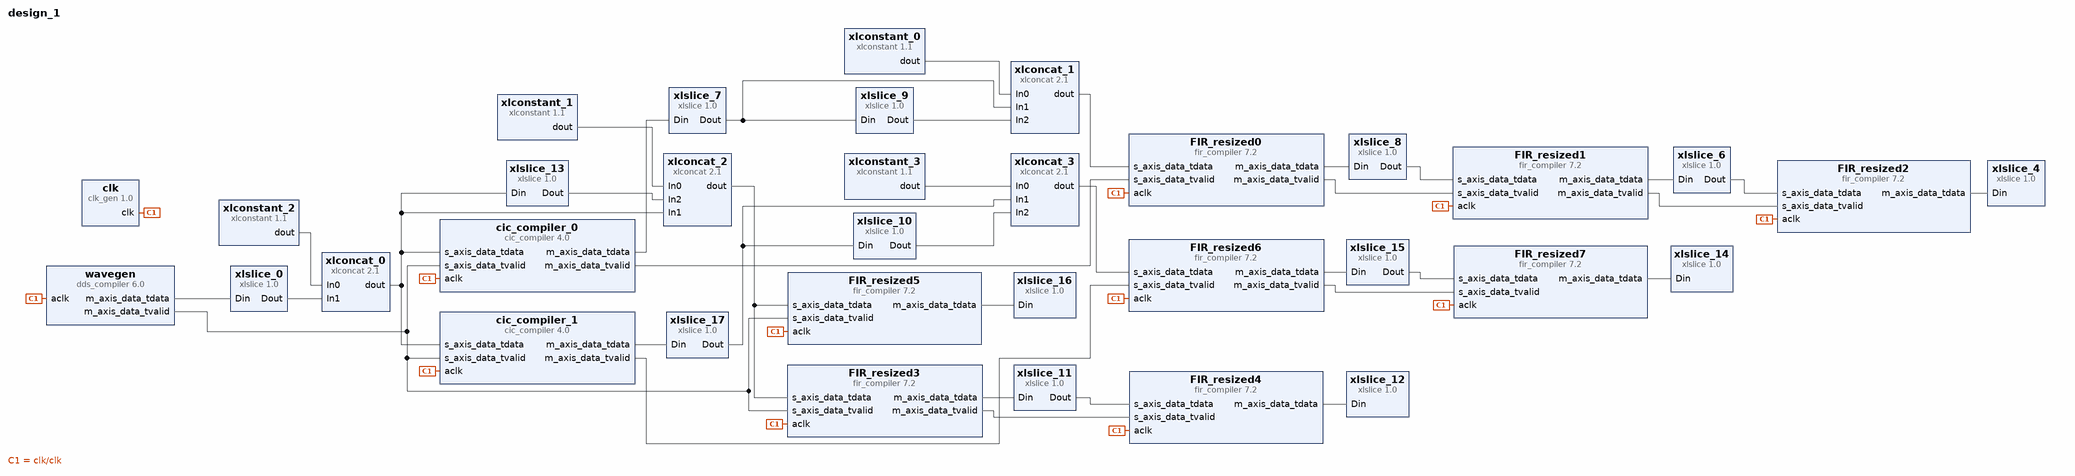
[diagram p0: block diagram of the top level]
# Vivado block design design_1, Vivado 2016.2
create_bd_design design_1

create_bd_cell -type ip -vlnv xilinx.com:ip:clk_gen:1.0 clk
set_property -dict {CONFIG.FREQ_HZ 125000000} [get_bd_cells clk]
create_bd_cell -type ip -vlnv xilinx.com:ip:dds_compiler:6.0 wavegen
set_property -dict [list \
  CONFIG.DDS_Clock_Rate 125 \
  CONFIG.Frequency_Resolution 0.4 \
  CONFIG.Noise_Shaping Auto \
  CONFIG.Phase_Width 29 \
  CONFIG.Output_Width 8 \
  CONFIG.Output_Frequency1 0.02 \
  CONFIG.PINC1 10100111110001011 \
] [get_bd_cells wavegen]
create_bd_cell -type ip -vlnv xilinx.com:ip:xlslice:1.0 xlslice_0
set_property -dict {CONFIG.DOUT_WIDTH 14 CONFIG.DIN_TO 2 CONFIG.DIN_FROM 15 CONFIG.DIN_WIDTH 16} [get_bd_cells xlslice_0]
create_bd_cell -type ip -vlnv xilinx.com:ip:xlconcat:2.1 xlconcat_0
set_property -dict {CONFIG.NUM_PORTS 2 CONFIG.IN0_WIDTH 2 CONFIG.IN1_WIDTH 14 CONFIG.IN2_WIDTH 1} [get_bd_cells xlconcat_0]
create_bd_cell -type ip -vlnv xilinx.com:ip:fir_compiler:7.2 FIR_resized1
set_property -dict [list \
  CONFIG.CoefficientSource COE_File \
  CONFIG.Coefficient_File ../../../../../../../pitaya/firmware/fpga/p_chain5/coefData/dec5flat.coe \
  CONFIG.Coefficient_Sets 1 \
  CONFIG.Filter_Type Decimation \
  CONFIG.Interpolation_Rate 1 \
  CONFIG.Decimation_Rate 5 \
  CONFIG.Zero_Pack_Factor 1 \
  CONFIG.Number_Channels 1 \
  CONFIG.RateSpecification Frequency_Specification \
  CONFIG.Sample_Frequency 125 \
  CONFIG.Clock_Frequency 125 \
  CONFIG.Coefficient_Sign Signed \
  CONFIG.Quantization Quantize_Only \
  CONFIG.Coefficient_Width 16 \
  CONFIG.Coefficient_Fractional_Bits 17 \
  CONFIG.Coefficient_Structure Inferred \
  CONFIG.Data_Width 24 \
  CONFIG.Data_Fractional_Bits 7 \
  CONFIG.Output_Rounding_Mode Truncate_LSBs \
  CONFIG.Output_Width 32 \
  CONFIG.Filter_Architecture Systolic_Multiply_Accumulate \
  CONFIG.ColumnConfig 7 \
] [get_bd_cells FIR_resized1]
create_bd_cell -type ip -vlnv xilinx.com:ip:xlslice:1.0 xlslice_4
set_property -dict {CONFIG.DOUT_WIDTH 24 CONFIG.DIN_TO 6 CONFIG.DIN_FROM 29 CONFIG.DIN_WIDTH 32} [get_bd_cells xlslice_4]
create_bd_cell -type ip -vlnv xilinx.com:ip:xlslice:1.0 xlslice_6
set_property -dict {CONFIG.DOUT_WIDTH 24 CONFIG.DIN_TO 7 CONFIG.DIN_FROM 30 CONFIG.DIN_WIDTH 32} [get_bd_cells xlslice_6]
create_bd_cell -type ip -vlnv xilinx.com:ip:fir_compiler:7.2 FIR_resized2
set_property -dict [list \
  CONFIG.CoefficientSource COE_File \
  CONFIG.Coefficient_File ../../../../../../../pitaya/firmware/fpga/p_chain5/coefData/dec5steep.coe \
  CONFIG.Coefficient_Sets 1 \
  CONFIG.Filter_Type Decimation \
  CONFIG.Interpolation_Rate 1 \
  CONFIG.Decimation_Rate 5 \
  CONFIG.Zero_Pack_Factor 1 \
  CONFIG.Number_Channels 1 \
  CONFIG.RateSpecification Frequency_Specification \
  CONFIG.Sample_Frequency 125 \
  CONFIG.Clock_Frequency 125 \
  CONFIG.Coefficient_Sign Signed \
  CONFIG.Quantization Quantize_Only \
  CONFIG.Coefficient_Width 16 \
  CONFIG.BestPrecision false \
  CONFIG.Coefficient_Fractional_Bits 17 \
  CONFIG.Coefficient_Structure Inferred \
  CONFIG.Data_Width 24 \
  CONFIG.Data_Fractional_Bits 7 \
  CONFIG.Output_Rounding_Mode Truncate_LSBs \
  CONFIG.Output_Width 32 \
  CONFIG.Filter_Architecture Systolic_Multiply_Accumulate \
  CONFIG.ColumnConfig 21 \
] [get_bd_cells FIR_resized2]
create_bd_cell -type ip -vlnv xilinx.com:ip:cic_compiler:4.0 cic_compiler_0
set_property -dict [list \
  CONFIG.Filter_Type Decimation \
  CONFIG.Number_Of_Stages 4 \
  CONFIG.Fixed_Or_Initial_Rate 25 \
  CONFIG.Minimum_Rate 25 \
  CONFIG.Maximum_Rate 25 \
  CONFIG.Input_Sample_Frequency 125 \
  CONFIG.Clock_Frequency 125 \
  CONFIG.SamplePeriod 1 \
  CONFIG.Input_Data_Width 16 \
  CONFIG.Output_Data_Width 35 \
] [get_bd_cells cic_compiler_0]
create_bd_cell -type ip -vlnv xilinx.com:ip:xlslice:1.0 xlslice_7
set_property -dict {CONFIG.DOUT_WIDTH 16 CONFIG.DIN_TO 19 CONFIG.DIN_FROM 34 CONFIG.DIN_WIDTH 40} [get_bd_cells xlslice_7]
create_bd_cell -type ip -vlnv xilinx.com:ip:fir_compiler:7.2 FIR_resized0
set_property -dict [list \
  CONFIG.CoefficientSource COE_File \
  CONFIG.Coefficient_File ../../../../../../../pitaya/firmware/fpga/p_chain5/coefData/comp025.coe \
  CONFIG.Coefficient_Sets 1 \
  CONFIG.Filter_Type Single_Rate \
  CONFIG.Interpolation_Rate 1 \
  CONFIG.Decimation_Rate 1 \
  CONFIG.Zero_Pack_Factor 1 \
  CONFIG.Number_Channels 1 \
  CONFIG.RateSpecification Frequency_Specification \
  CONFIG.Sample_Frequency 5 \
  CONFIG.Clock_Frequency 125 \
  CONFIG.Coefficient_Sign Signed \
  CONFIG.Quantization Quantize_Only \
  CONFIG.Coefficient_Width 16 \
  CONFIG.Coefficient_Fractional_Bits 16 \
  CONFIG.Coefficient_Structure Inferred \
  CONFIG.Data_Width 24 \
  CONFIG.Data_Fractional_Bits 7 \
  CONFIG.Output_Rounding_Mode Truncate_LSBs \
  CONFIG.Output_Width 32 \
  CONFIG.Filter_Architecture Systolic_Multiply_Accumulate \
  CONFIG.ColumnConfig 1 \
] [get_bd_cells FIR_resized0]
create_bd_cell -type ip -vlnv xilinx.com:ip:xlslice:1.0 xlslice_8
set_property -dict {CONFIG.DOUT_WIDTH 24 CONFIG.DIN_TO 7 CONFIG.DIN_FROM 30 CONFIG.DIN_WIDTH 32} [get_bd_cells xlslice_8]
create_bd_cell -type ip -vlnv xilinx.com:ip:xlconcat:2.1 xlconcat_1
set_property -dict {CONFIG.NUM_PORTS 3 CONFIG.IN0_WIDTH 7 CONFIG.IN1_WIDTH 16 CONFIG.IN2_WIDTH 1} [get_bd_cells xlconcat_1]
create_bd_cell -type ip -vlnv xilinx.com:ip:xlconstant:1.1 xlconstant_0
set_property -dict {CONFIG.CONST_WIDTH 7 CONFIG.CONST_VAL 0} [get_bd_cells xlconstant_0]
create_bd_cell -type ip -vlnv xilinx.com:ip:xlslice:1.0 xlslice_9
set_property -dict {CONFIG.DOUT_WIDTH 1 CONFIG.DIN_TO 15 CONFIG.DIN_FROM 15 CONFIG.DIN_WIDTH 16} [get_bd_cells xlslice_9]
create_bd_cell -type ip -vlnv xilinx.com:ip:fir_compiler:7.2 FIR_resized3
set_property -dict [list \
  CONFIG.CoefficientSource COE_File \
  CONFIG.Coefficient_File ../../../../../../../pitaya/firmware/fpga/p_chain5/coefData/dec5flat.coe \
  CONFIG.Coefficient_Sets 1 \
  CONFIG.Filter_Type Decimation \
  CONFIG.Interpolation_Rate 1 \
  CONFIG.Decimation_Rate 5 \
  CONFIG.Zero_Pack_Factor 1 \
  CONFIG.Number_Channels 1 \
  CONFIG.RateSpecification Frequency_Specification \
  CONFIG.Sample_Frequency 125 \
  CONFIG.Clock_Frequency 125 \
  CONFIG.Coefficient_Sign Signed \
  CONFIG.Quantization Quantize_Only \
  CONFIG.Coefficient_Width 16 \
  CONFIG.Coefficient_Fractional_Bits 17 \
  CONFIG.Coefficient_Structure Inferred \
  CONFIG.Data_Width 24 \
  CONFIG.Data_Fractional_Bits 7 \
  CONFIG.Output_Rounding_Mode Truncate_LSBs \
  CONFIG.Output_Width 32 \
  CONFIG.Filter_Architecture Systolic_Multiply_Accumulate \
  CONFIG.ColumnConfig 7 \
] [get_bd_cells FIR_resized3]
create_bd_cell -type ip -vlnv xilinx.com:ip:xlslice:1.0 xlslice_11
set_property -dict {CONFIG.DOUT_WIDTH 24 CONFIG.DIN_TO 7 CONFIG.DIN_FROM 30 CONFIG.DIN_WIDTH 32} [get_bd_cells xlslice_11]
create_bd_cell -type ip -vlnv xilinx.com:ip:fir_compiler:7.2 FIR_resized4
set_property -dict [list \
  CONFIG.CoefficientSource COE_File \
  CONFIG.Coefficient_File ../../../../../../../pitaya/firmware/fpga/p_chain5/coefData/dec5steep.coe \
  CONFIG.Coefficient_Sets 1 \
  CONFIG.Filter_Type Decimation \
  CONFIG.Interpolation_Rate 1 \
  CONFIG.Decimation_Rate 5 \
  CONFIG.Zero_Pack_Factor 1 \
  CONFIG.Number_Channels 1 \
  CONFIG.RateSpecification Frequency_Specification \
  CONFIG.Sample_Frequency 125 \
  CONFIG.Clock_Frequency 125 \
  CONFIG.Coefficient_Sign Signed \
  CONFIG.Quantization Quantize_Only \
  CONFIG.Coefficient_Width 16 \
  CONFIG.BestPrecision false \
  CONFIG.Coefficient_Fractional_Bits 17 \
  CONFIG.Coefficient_Structure Inferred \
  CONFIG.Data_Width 24 \
  CONFIG.Data_Fractional_Bits 7 \
  CONFIG.Output_Rounding_Mode Truncate_LSBs \
  CONFIG.Output_Width 32 \
  CONFIG.Filter_Architecture Systolic_Multiply_Accumulate \
  CONFIG.ColumnConfig 21 \
] [get_bd_cells FIR_resized4]
create_bd_cell -type ip -vlnv xilinx.com:ip:xlslice:1.0 xlslice_12
set_property -dict {CONFIG.DOUT_WIDTH 24 CONFIG.DIN_TO 6 CONFIG.DIN_FROM 29 CONFIG.DIN_WIDTH 32} [get_bd_cells xlslice_12]
create_bd_cell -type ip -vlnv xilinx.com:ip:xlconcat:2.1 xlconcat_2
set_property -dict {CONFIG.NUM_PORTS 3 CONFIG.IN0_WIDTH 7 CONFIG.IN1_WIDTH 16 CONFIG.IN2_WIDTH 1} [get_bd_cells xlconcat_2]
create_bd_cell -type ip -vlnv xilinx.com:ip:xlconstant:1.1 xlconstant_1
set_property -dict {CONFIG.CONST_WIDTH 7 CONFIG.CONST_VAL 0} [get_bd_cells xlconstant_1]
create_bd_cell -type ip -vlnv xilinx.com:ip:xlslice:1.0 xlslice_13
set_property -dict {CONFIG.DOUT_WIDTH 1 CONFIG.DIN_TO 15 CONFIG.DIN_FROM 15 CONFIG.DIN_WIDTH 16} [get_bd_cells xlslice_13]
create_bd_cell -type ip -vlnv xilinx.com:ip:xlconstant:1.1 xlconstant_2
set_property -dict {CONFIG.CONST_WIDTH 2 CONFIG.CONST_VAL 0} [get_bd_cells xlconstant_2]
create_bd_cell -type ip -vlnv xilinx.com:ip:fir_compiler:7.2 FIR_resized5
set_property -dict [list \
  CONFIG.CoefficientSource COE_File \
  CONFIG.Coefficient_File ../../../../../../../pitaya/firmware/fpga/p_chain5/coefData/dec5steep.coe \
  CONFIG.Coefficient_Sets 1 \
  CONFIG.Filter_Type Decimation \
  CONFIG.Interpolation_Rate 1 \
  CONFIG.Decimation_Rate 5 \
  CONFIG.Zero_Pack_Factor 1 \
  CONFIG.Number_Channels 1 \
  CONFIG.RateSpecification Frequency_Specification \
  CONFIG.Sample_Frequency 125 \
  CONFIG.Clock_Frequency 125 \
  CONFIG.Coefficient_Sign Signed \
  CONFIG.Quantization Quantize_Only \
  CONFIG.Coefficient_Width 16 \
  CONFIG.BestPrecision false \
  CONFIG.Coefficient_Fractional_Bits 17 \
  CONFIG.Coefficient_Structure Inferred \
  CONFIG.Data_Width 24 \
  CONFIG.Data_Fractional_Bits 7 \
  CONFIG.Output_Rounding_Mode Truncate_LSBs \
  CONFIG.Output_Width 32 \
  CONFIG.Filter_Architecture Systolic_Multiply_Accumulate \
  CONFIG.ColumnConfig 21 \
] [get_bd_cells FIR_resized5]
create_bd_cell -type ip -vlnv xilinx.com:ip:xlslice:1.0 xlslice_16
set_property -dict {CONFIG.DOUT_WIDTH 24 CONFIG.DIN_TO 6 CONFIG.DIN_FROM 29 CONFIG.DIN_WIDTH 32} [get_bd_cells xlslice_16]
create_bd_cell -type ip -vlnv xilinx.com:ip:cic_compiler:4.0 cic_compiler_1
set_property -dict [list \
  CONFIG.Filter_Type Decimation \
  CONFIG.Number_Of_Stages 4 \
  CONFIG.Fixed_Or_Initial_Rate 125 \
  CONFIG.Minimum_Rate 125 \
  CONFIG.Maximum_Rate 125 \
  CONFIG.Input_Sample_Frequency 125 \
  CONFIG.Clock_Frequency 125 \
  CONFIG.SamplePeriod 1 \
  CONFIG.Input_Data_Width 16 \
  CONFIG.Output_Data_Width 44 \
] [get_bd_cells cic_compiler_1]
create_bd_cell -type ip -vlnv xilinx.com:ip:fir_compiler:7.2 FIR_resized6
set_property -dict [list \
  CONFIG.CoefficientSource COE_File \
  CONFIG.Coefficient_File ../../../../../../../pitaya/firmware/fpga/p_chain5/coefData/comp125.coe \
  CONFIG.Coefficient_Sets 1 \
  CONFIG.Filter_Type Decimation \
  CONFIG.Interpolation_Rate 1 \
  CONFIG.Decimation_Rate 5 \
  CONFIG.Zero_Pack_Factor 1 \
  CONFIG.Number_Channels 1 \
  CONFIG.RateSpecification Frequency_Specification \
  CONFIG.Sample_Frequency 1 \
  CONFIG.Clock_Frequency 125 \
  CONFIG.Coefficient_Sign Signed \
  CONFIG.Quantization Quantize_Only \
  CONFIG.Coefficient_Width 16 \
  CONFIG.Coefficient_Fractional_Bits 16 \
  CONFIG.Coefficient_Structure Inferred \
  CONFIG.Data_Width 24 \
  CONFIG.Data_Fractional_Bits 7 \
  CONFIG.Output_Rounding_Mode Truncate_LSBs \
  CONFIG.Output_Width 32 \
  CONFIG.Filter_Architecture Systolic_Multiply_Accumulate \
  CONFIG.ColumnConfig 1 \
] [get_bd_cells FIR_resized6]
create_bd_cell -type ip -vlnv xilinx.com:ip:fir_compiler:7.2 FIR_resized7
set_property -dict [list \
  CONFIG.CoefficientSource COE_File \
  CONFIG.Coefficient_File ../../../../../../../pitaya/firmware/fpga/p_chain5/coefData/halfband.coe \
  CONFIG.Coefficient_Sets 1 \
  CONFIG.Filter_Type Decimation \
  CONFIG.Interpolation_Rate 1 \
  CONFIG.Decimation_Rate 2 \
  CONFIG.Zero_Pack_Factor 1 \
  CONFIG.Number_Channels 1 \
  CONFIG.RateSpecification Frequency_Specification \
  CONFIG.Sample_Frequency 0.5 \
  CONFIG.Clock_Frequency 125 \
  CONFIG.Coefficient_Sign Signed \
  CONFIG.Quantization Quantize_Only \
  CONFIG.Coefficient_Width 16 \
  CONFIG.BestPrecision false \
  CONFIG.Coefficient_Fractional_Bits 15 \
  CONFIG.Coefficient_Structure Inferred \
  CONFIG.Data_Width 24 \
  CONFIG.Data_Fractional_Bits 7 \
  CONFIG.Output_Rounding_Mode Truncate_LSBs \
  CONFIG.Output_Width 32 \
  CONFIG.Filter_Architecture Systolic_Multiply_Accumulate \
  CONFIG.ColumnConfig 1 \
] [get_bd_cells FIR_resized7]
create_bd_cell -type ip -vlnv xilinx.com:ip:xlslice:1.0 xlslice_14
set_property -dict {CONFIG.DOUT_WIDTH 24 CONFIG.DIN_TO 7 CONFIG.DIN_FROM 30 CONFIG.DIN_WIDTH 32} [get_bd_cells xlslice_14]
create_bd_cell -type ip -vlnv xilinx.com:ip:xlslice:1.0 xlslice_15
set_property -dict {CONFIG.DOUT_WIDTH 24 CONFIG.DIN_TO 7 CONFIG.DIN_FROM 30 CONFIG.DIN_WIDTH 32} [get_bd_cells xlslice_15]
create_bd_cell -type ip -vlnv xilinx.com:ip:xlconcat:2.1 xlconcat_3
set_property -dict {CONFIG.NUM_PORTS 3 CONFIG.IN0_WIDTH 7 CONFIG.IN1_WIDTH 16 CONFIG.IN2_WIDTH 1} [get_bd_cells xlconcat_3]
create_bd_cell -type ip -vlnv xilinx.com:ip:xlconstant:1.1 xlconstant_3
set_property -dict {CONFIG.CONST_WIDTH 7 CONFIG.CONST_VAL 0} [get_bd_cells xlconstant_3]
create_bd_cell -type ip -vlnv xilinx.com:ip:xlslice:1.0 xlslice_10
set_property -dict {CONFIG.DOUT_WIDTH 1 CONFIG.DIN_TO 15 CONFIG.DIN_FROM 15 CONFIG.DIN_WIDTH 16} [get_bd_cells xlslice_10]
create_bd_cell -type ip -vlnv xilinx.com:ip:xlslice:1.0 xlslice_17
set_property -dict {CONFIG.DOUT_WIDTH 16 CONFIG.DIN_TO 29 CONFIG.DIN_FROM 44 CONFIG.DIN_WIDTH 48} [get_bd_cells xlslice_17]

# ---- connections ----

connect_bd_net [get_bd_pins clk/clk] \
  [get_bd_pins wavegen/aclk] [get_bd_pins FIR_resized1/aclk] [get_bd_pins FIR_resized2/aclk] \
  [get_bd_pins cic_compiler_0/aclk] [get_bd_pins FIR_resized0/aclk] [get_bd_pins FIR_resized4/aclk] \
  [get_bd_pins FIR_resized3/aclk] [get_bd_pins FIR_resized5/aclk] [get_bd_pins cic_compiler_1/aclk] \
  [get_bd_pins FIR_resized6/aclk] [get_bd_pins FIR_resized7/aclk]
connect_bd_net [get_bd_pins FIR_resized1/m_axis_data_tdata] [get_bd_pins xlslice_6/Din]
connect_bd_net [get_bd_pins xlslice_6/Dout] [get_bd_pins FIR_resized2/s_axis_data_tdata]
connect_bd_net [get_bd_pins FIR_resized2/m_axis_data_tdata] [get_bd_pins xlslice_4/Din]
connect_bd_net [get_bd_pins FIR_resized1/m_axis_data_tvalid] [get_bd_pins FIR_resized2/s_axis_data_tvalid]
connect_bd_net [get_bd_pins cic_compiler_0/m_axis_data_tdata] [get_bd_pins xlslice_7/Din]
connect_bd_net -net FIR_resized3_m_axis_data_tdata [get_bd_pins FIR_resized0/m_axis_data_tdata] [get_bd_pins xlslice_8/Din]
connect_bd_net [get_bd_pins cic_compiler_0/m_axis_data_tvalid] [get_bd_pins FIR_resized0/s_axis_data_tvalid]
connect_bd_net -net FIR_resized3_m_axis_data_tvalid [get_bd_pins FIR_resized0/m_axis_data_tvalid] [get_bd_pins FIR_resized1/s_axis_data_tvalid]
connect_bd_net [get_bd_pins xlslice_8/Dout] [get_bd_pins FIR_resized1/s_axis_data_tdata]
connect_bd_net [get_bd_pins xlconcat_1/dout] [get_bd_pins FIR_resized0/s_axis_data_tdata]
connect_bd_net [get_bd_pins xlslice_7/Dout] [get_bd_pins xlconcat_1/In1] [get_bd_pins xlslice_9/Din]
connect_bd_net [get_bd_pins xlconstant_0/dout] [get_bd_pins xlconcat_1/In0]
connect_bd_net [get_bd_pins xlslice_9/Dout] [get_bd_pins xlconcat_1/In2]
connect_bd_net [get_bd_pins FIR_resized4/m_axis_data_tdata] [get_bd_pins xlslice_12/Din]
connect_bd_net [get_bd_pins xlslice_11/Dout] [get_bd_pins FIR_resized4/s_axis_data_tdata]
connect_bd_net [get_bd_pins FIR_resized3/m_axis_data_tdata] [get_bd_pins xlslice_11/Din]
connect_bd_net [get_bd_pins FIR_resized3/m_axis_data_tvalid] [get_bd_pins FIR_resized4/s_axis_data_tvalid]
connect_bd_net [get_bd_pins xlconstant_1/dout] [get_bd_pins xlconcat_2/In0]
connect_bd_net [get_bd_pins xlslice_13/Dout] [get_bd_pins xlconcat_2/In2]
connect_bd_net [get_bd_pins xlconcat_2/dout] [get_bd_pins FIR_resized3/s_axis_data_tdata] [get_bd_pins FIR_resized5/s_axis_data_tdata]
connect_bd_net [get_bd_pins xlslice_0/Dout] [get_bd_pins xlconcat_0/In1]
connect_bd_net [get_bd_pins wavegen/m_axis_data_tdata] [get_bd_pins xlslice_0/Din]
connect_bd_net [get_bd_pins xlconstant_2/dout] [get_bd_pins xlconcat_0/In0]
connect_bd_net [get_bd_pins FIR_resized5/m_axis_data_tdata] [get_bd_pins xlslice_16/Din]
connect_bd_net [get_bd_pins xlconcat_0/dout] \
  [get_bd_pins cic_compiler_0/s_axis_data_tdata] [get_bd_pins xlconcat_2/In1] [get_bd_pins xlslice_13/Din] \
  [get_bd_pins cic_compiler_1/s_axis_data_tdata]
connect_bd_net [get_bd_pins wavegen/m_axis_data_tvalid] \
  [get_bd_pins cic_compiler_0/s_axis_data_tvalid] [get_bd_pins FIR_resized3/s_axis_data_tvalid] \
  [get_bd_pins FIR_resized5/s_axis_data_tvalid] [get_bd_pins cic_compiler_1/s_axis_data_tvalid]
connect_bd_net [get_bd_pins cic_compiler_1/m_axis_data_tvalid] [get_bd_pins FIR_resized6/s_axis_data_tvalid]
connect_bd_net [get_bd_pins FIR_resized6/m_axis_data_tvalid] [get_bd_pins FIR_resized7/s_axis_data_tvalid]
connect_bd_net [get_bd_pins FIR_resized6/m_axis_data_tdata] [get_bd_pins xlslice_15/Din]
connect_bd_net [get_bd_pins xlslice_15/Dout] [get_bd_pins FIR_resized7/s_axis_data_tdata]
connect_bd_net [get_bd_pins FIR_resized7/m_axis_data_tdata] [get_bd_pins xlslice_14/Din]
connect_bd_net [get_bd_pins cic_compiler_1/m_axis_data_tdata] [get_bd_pins xlslice_17/Din]
connect_bd_net [get_bd_pins xlslice_17/Dout] [get_bd_pins xlconcat_3/In1] [get_bd_pins xlslice_10/Din]
connect_bd_net [get_bd_pins xlconstant_3/dout] [get_bd_pins xlconcat_3/In0]
connect_bd_net [get_bd_pins xlslice_10/Dout] [get_bd_pins xlconcat_3/In2]
connect_bd_net [get_bd_pins xlconcat_3/dout] [get_bd_pins FIR_resized6/s_axis_data_tdata]

validate_bd_design
save_bd_design
